# EAGLE design M115 (EAGLE 6.6.0)
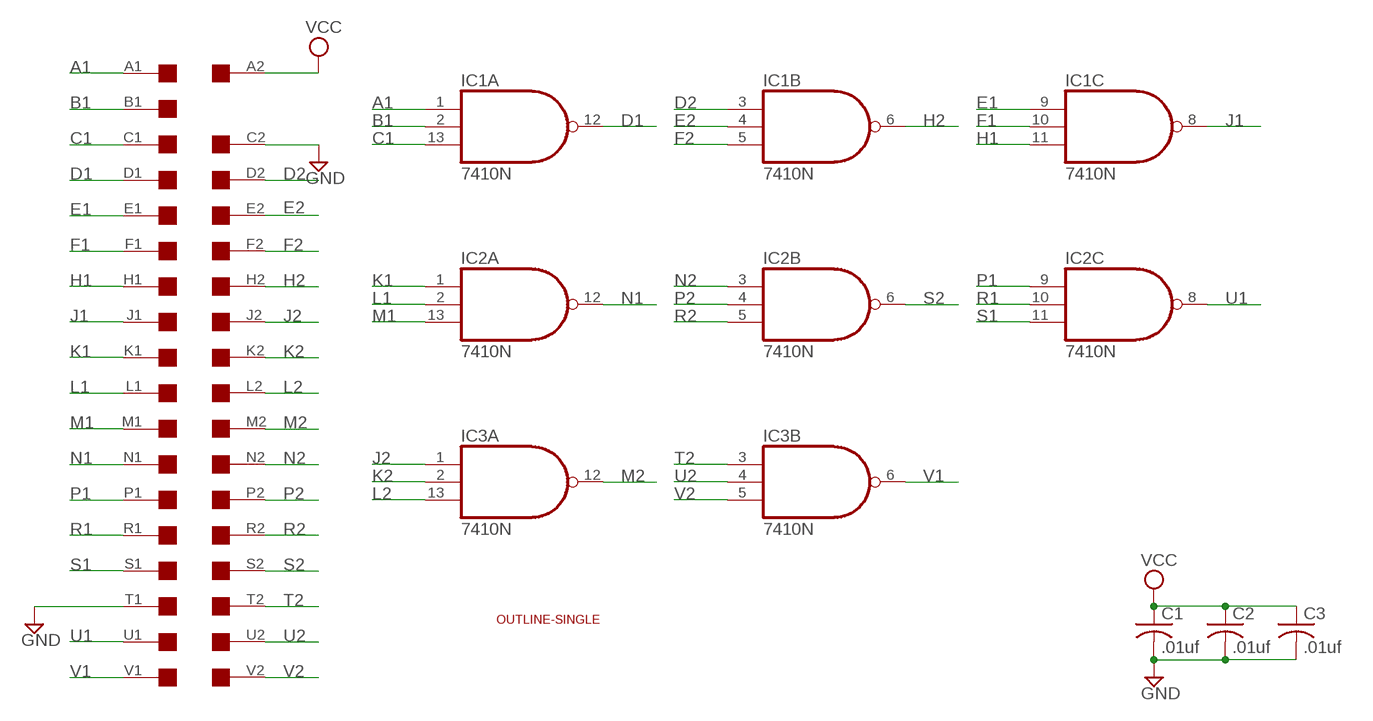
[diagram p0: schematic, sheet 1]

## Parts
C1  .01uf  C-US050-025X075  [C050-025X075]
C2  .01uf  C-US050-025X075  [C050-025X075]
C3  .01uf  C-US050-025X075  [C050-025X075]
IC1  7410N  [DIL14]
IC2  7410N  [DIL14]
IC3  7410N  [DIL14]
U$1  SINGLE  [EDGE-CON2]
U$4  OUTLINE-SINGLE  [SINGLE]

## Nets
A1: IC1.1(A:I0) U$1.A1
B1: IC1.2(A:I1) U$1.B1
C1: IC1.13(A:I2) U$1.C1
D1: IC1.12(A:O) U$1.D1
D2: IC1.3(B:I0) U$1.D2
E1: IC1.9(C:I0) U$1.E1
E2: IC1.4(B:I1) U$1.E2
F1: IC1.10(C:I1) U$1.F1
F2: IC1.5(B:I2) U$1.F2
GND: C1.2 C2.2 C3.2 U$1.C2 U$1.T1
H1: IC1.11(C:I2) U$1.H1
H2: IC1.6(B:O) U$1.H2
J1: IC1.8(C:O) U$1.J1
J2: IC3.1(A:I0) U$1.J2
K1: IC2.1(A:I0) U$1.K1
K2: IC3.2(A:I1) U$1.K2
L1: IC2.2(A:I1) U$1.L1
L2: IC3.13(A:I2) U$1.L2
M1: IC2.13(A:I2) U$1.M1
M2: IC3.12(A:O) U$1.M2
N1: IC2.12(A:O) U$1.N1
N2: IC2.3(B:I0) U$1.N2
P1: IC2.9(C:I0) U$1.P1
P2: IC2.4(B:I1) U$1.P2
R1: IC2.10(C:I1) U$1.R1
R2: IC2.5(B:I2) U$1.R2
S1: IC2.11(C:I2) U$1.S1
S2: IC2.6(B:O) U$1.S2
T2: IC3.3(B:I0) U$1.T2
U1: IC2.8(C:O) U$1.U1
U2: IC3.4(B:I1) U$1.U2
V1: IC3.6(B:O) U$1.V1
V2: IC3.5(B:I2) U$1.V2
VCC: C1.1 C2.1 C3.1 U$1.A2
Unconnected: IC3.8(C:O) IC3.9(C:I0) IC3.10(C:I1) IC3.11(C:I2) U$1.B2

## Power pins joined to a net without a drawn wire
GND: IC1.7(P:GND) IC2.7(P:GND) IC3.7(P:GND)
VCC: IC1.14(P:VCC) IC2.14(P:VCC) IC3.14(P:VCC)

## Library data of the parts
C1-C3 = rcl:C-US: CAPACITOR, American symbol
IC1-IC3 = 74xx-us:74*10: Triple 3-input NAND gate
U$1 = dec-con:SINGLE: Single-Height DEC board
U$4 = dec-con:OUTLINE-*: Board outlines for DEC boards.

## Board
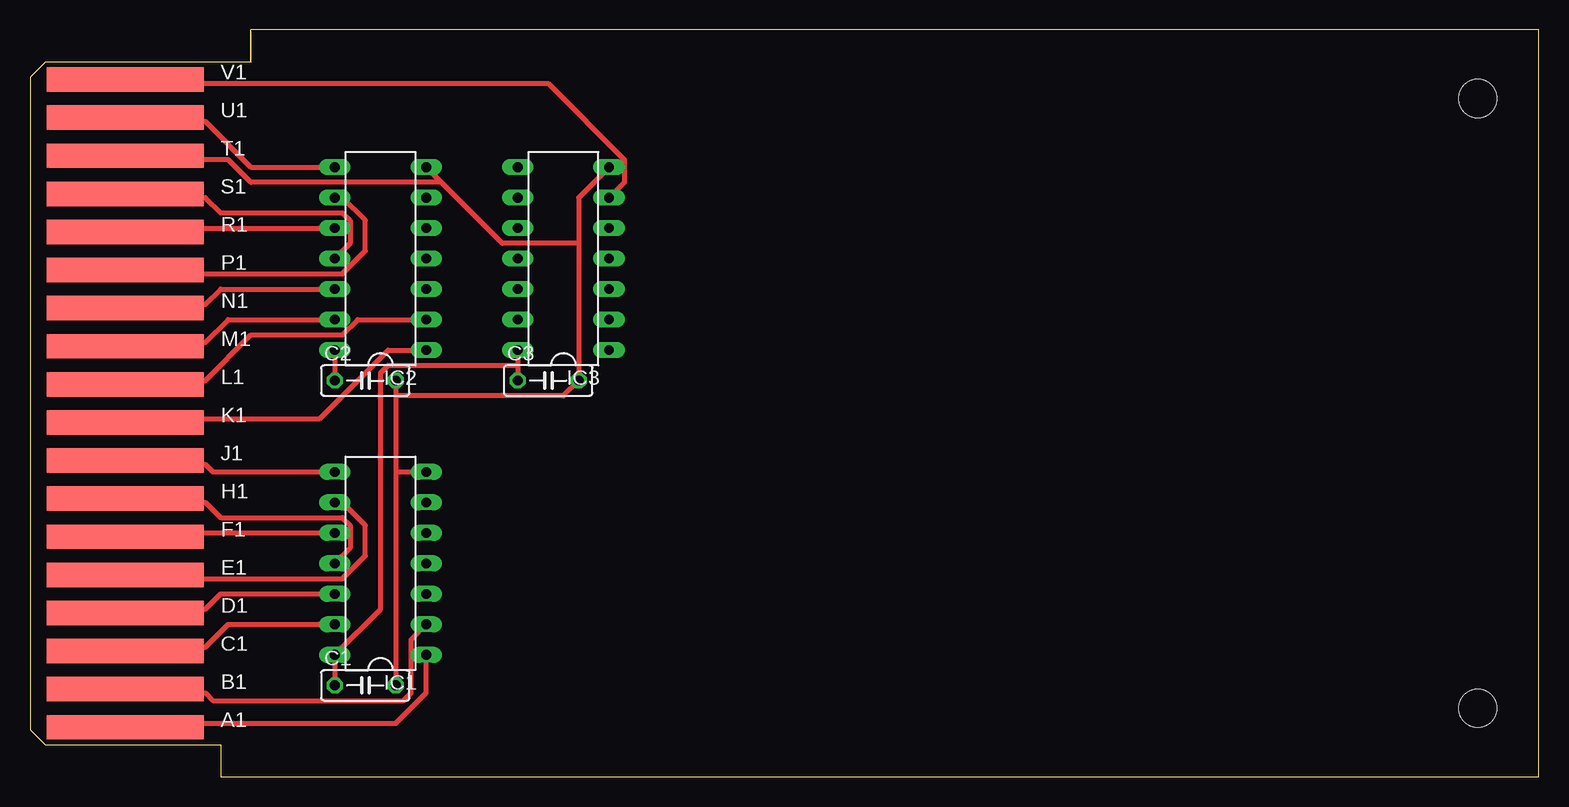
[diagram p1: board, top side]
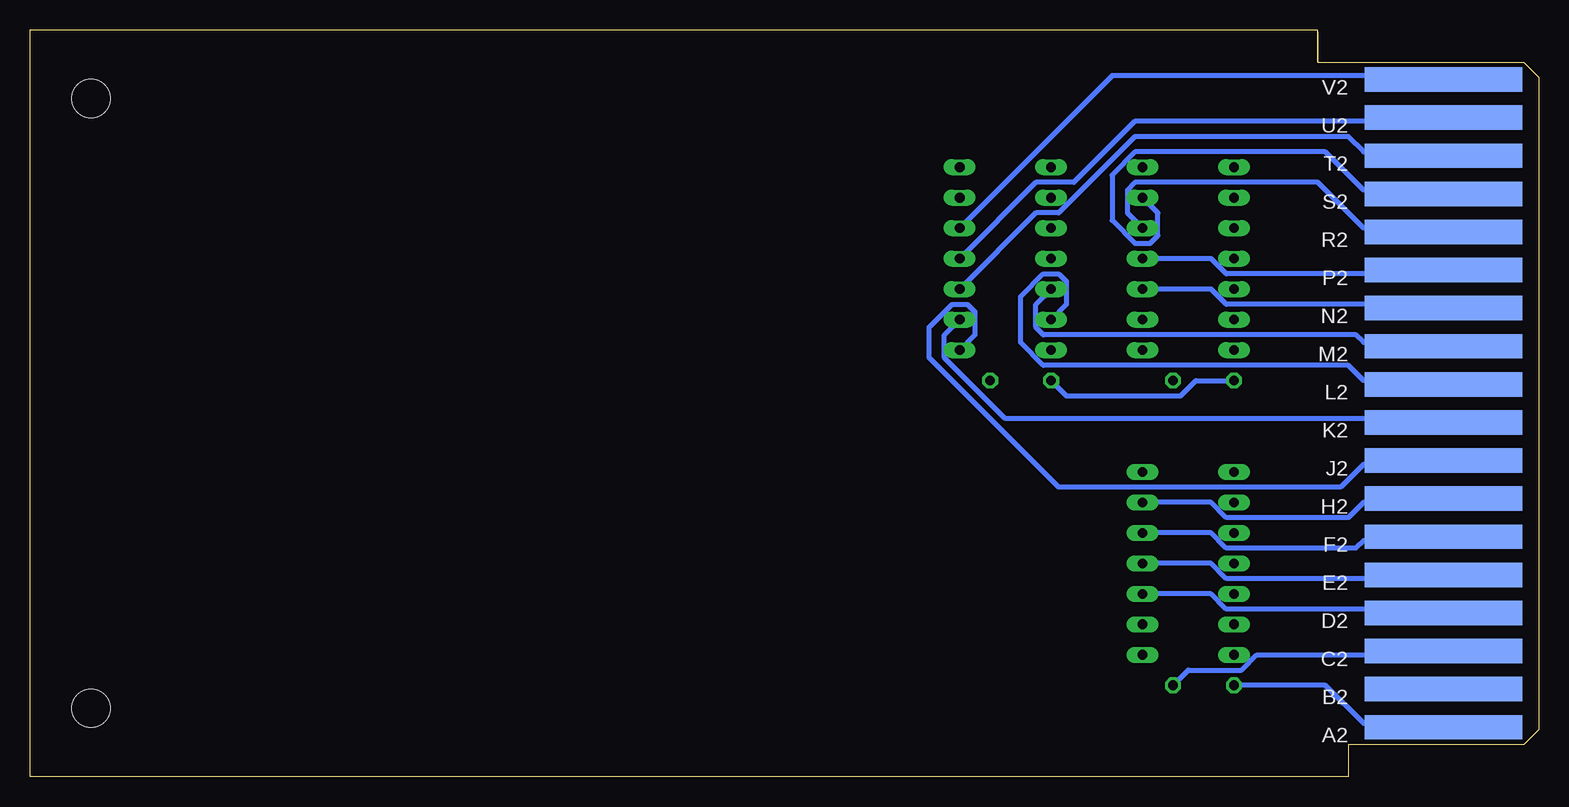
[diagram p2: board, bottom side, seen from below]

Size 125.73 x 62.23 mm. Coordinates in mm from the lower left corner, seen from the top.
Copper layers (1+16): Top 0.035mm / dielectric 1.5mm / Bottom 0.035mm
Design rules "16mils": minimum track width 16mil, minimum drill 32mil, track to track 15mil, track to pad 10mil, pad to pad 10mil, via to via 10mil, smd to smd 10mil, copper to edge 13mil, drill to drill 10mil, minimum pad ring 10mil, minimum via ring 8mil, stop-mask expansion 0mil, vias tented up to drill 0mil, thermal gap 10mil

### Footprints (pad centres in the part's own frame; a part is rotated, then mirrored left to right if it is on the bottom)
C050-025X075 = drill 0.813 octagon: 1 -2.54,0; 2 2.54,0
DIL14 = drill 0.813 long: 1 -7.62,-3.81; 2 -5.08,-3.81; 3 -2.54,-3.81; 4 0,-3.81; 5 2.54,-3.81; 6 5.08,-3.81; 7 7.62,-3.81; 8 7.62,3.81; 9 5.08,3.81; 10 2.54,3.81; 11 0,3.81; 12 -2.54,3.81; 13 -5.08,3.81; 14 -7.62,3.81
EDGE-CON2 = smd 13.106 x 2.032: A1 7.938,4.128; B1 7.938,7.303; C1 7.938,10.477; D1 7.938,13.652; E1 7.938,16.828; F1 7.938,20.003; H1 7.938,23.177; J1 7.938,26.352; K1 7.938,29.527; L1 7.938,32.703; M1 7.938,35.877; N1 7.938,39.053; P1 7.938,42.227; R1 7.938,45.403; S1 7.938,48.578; T1 7.938,51.752; U1 7.938,54.928; V1 7.938,58.102 | smd 13.106 x 2.032 bottom: A2 7.938,4.128; B2 7.938,7.303; C2 7.938,10.477; D2 7.938,13.652; E2 7.938,16.828; F2 7.938,20.003; H2 7.938,23.177; J2 7.938,26.352; K2 7.938,29.527; L2 7.938,32.703; M2 7.938,35.877; N2 7.938,39.053; P2 7.938,42.227; R2 7.938,45.403; S2 7.938,48.578; T2 7.938,51.752; U2 7.938,54.928; V2 7.938,58.102
SINGLE = hole 3.175: 120.65,56.515; 120.65,5.715

### Placement (x,y rotation side)
C1  27.94,7.62 0 top
C2  27.94,33.02 0 top
C3  43.18,33.02 0 top
IC1  29.21,17.78 90 top
IC2  29.21,43.18 90 top
IC3  44.45,43.18 90 top
U$1  0,0 0 top
U$4  0,0 0 top

### Tracks (layer width: path | path; a pad name or v marks a point on that pad's centre or on a via)
A1
  Top 0.406: IC1.1 33.02,6.99 30.48,4.45 8.26,4.45 U$1.A1
B1
  Top 0.406: IC1.2 31.75,11.43 31.75,6.99 31.12,6.35 15.24,6.35 14.61,6.99 8.26,6.99 U$1.B1
C1
  Top 0.406: IC1.13 16.51,12.7 14.61,10.79 8.26,10.79 U$1.C1
D1
  Top 0.406: IC1.12 15.88,15.24 14.61,13.97 8.26,13.97 U$1.D1
D2
  Bottom 0.406: IC1.3 27.31,15.24 26.04,13.97 8.26,13.97 U$1.D2
E1
  Top 0.406: IC1.9 26.04,22.86 27.94,20.95 27.94,18.41 26.04,16.51 8.26,16.51 U$1.E1
E2
  Bottom 0.406: IC1.4 27.31,17.78 26.04,16.51 8.26,16.51 U$1.E2
F1
  Top 0.406: IC1.10 8.26,20.32 U$1.F1
F2
  Bottom 0.406: IC1.5 27.31,20.32 26.04,19.05 15.24,19.05 14.61,19.68 8.26,19.68 U$1.F2
GND
  Top 0.406: C2.2 30.48,31.75 | 30.48,31.75 30.48,25.4 | 30.48,25.4 C1.2 | 30.48,25.4 IC1.7 | 45.72,44.45 45.72,48.26 IC3.7 | 45.72,44.45 C3.2 44.45,31.75 30.48,31.75 | 34.29,49.53 39.37,44.45 45.72,44.45 | 34.29,49.53 IC2.7 | 34.29,49.53 18.42,49.53 16.51,51.44 8.26,51.44 U$1.T1
  Bottom 0.406: C1.2 29.21,8.89 24.77,8.89 23.5,10.16 8.26,10.16 U$1.C2
H1
  Top 0.406: IC1.11 26.67,19.05 26.67,20.95 26.04,21.59 15.88,21.59 14.61,22.86 8.26,22.86 U$1.H1
H2
  Bottom 0.406: IC1.6 27.31,22.86 26.04,21.59 15.88,21.59 14.61,22.86 8.26,22.86 U$1.H2
J1
  Top 0.406: IC1.8 15.24,25.4 14.61,26.04 8.26,26.04 U$1.J1
J2
  Bottom 0.406: IC3.1 46.99,36.83 46.99,38.73 47.63,39.37 48.9,39.37 50.8,37.47 50.8,34.92 40.01,24.13 16.51,24.13 14.61,26.04 8.26,26.04 U$1.J2
K1
  Top 0.406: IC2.1 29.85,35.56 24.13,29.84 8.26,29.84 U$1.K1
K2
  Bottom 0.406: IC3.2 49.53,36.83 49.53,34.92 44.45,29.84 8.26,29.84 U$1.K2
L1
  Top 0.406: IC2.2 27.31,38.1 26.04,36.83 18.42,36.83 14.61,33.02 8.26,33.02 U$1.L1
L2
  Bottom 0.406: IC3.13 39.37,39.37 39.37,41.27 40.01,41.91 41.28,41.91 43.18,40.01 43.18,36.2 41.28,34.29 15.88,34.29 14.61,33.02 8.26,33.02 U$1.L2
M1
  Top 0.406: IC2.13 16.51,38.1 14.61,36.2 8.26,36.2 U$1.M1
M2
  Bottom 0.406: IC3.12 41.91,39.37 41.91,37.47 41.28,36.83 15.24,36.83 14.61,36.2 8.26,36.2 U$1.M2
N1
  Top 0.406: IC2.12 15.88,40.64 14.61,39.37 8.26,39.37 U$1.N1
N2
  Bottom 0.406: IC2.3 27.31,40.64 26.04,39.37 8.26,39.37 U$1.N2
P1
  Top 0.406: IC2.9 26.04,48.26 27.94,46.35 27.94,43.81 26.04,41.91 8.26,41.91 U$1.P1
P2
  Bottom 0.406: IC2.4 27.31,43.18 26.04,41.91 8.26,41.91 U$1.P2
R1
  Top 0.406: IC2.10 8.26,45.72 U$1.R1
R2
  Bottom 0.406: IC2.5 34.29,46.99 34.29,48.9 33.66,49.53 18.42,49.53 14.61,45.72 8.26,45.72 U$1.R2
S1
  Top 0.406: IC2.11 26.67,44.45 26.67,46.35 26.04,46.99 15.88,46.99 14.61,48.26 8.26,48.26 U$1.S1
S2
  Bottom 0.406: IC2.6 31.75,46.99 31.75,45.09 32.39,44.45 33.66,44.45 35.56,46.35 35.56,50.16 33.66,52.07 17.78,52.07 14.61,48.9 8.26,48.9 U$1.S2
T2
  Bottom 0.406: IC3.3 41.91,46.99 40.01,46.99 33.66,53.34 15.88,53.34 14.61,52.07 8.26,52.07 U$1.T2
U1
  Top 0.406: IC2.8 18.42,50.8 14.61,54.61 8.26,54.61 U$1.U1
U2
  Bottom 0.406: IC3.4 41.91,49.53 38.74,49.53 33.66,54.61 8.26,54.61 U$1.U2
V1
  Top 0.406: IC3.6 49.53,49.53 49.53,51.44 43.18,57.78 8.26,57.78 U$1.V1
V2
  Bottom 0.406: IC3.5 35.56,58.42 8.26,58.42 U$1.V2
VCC
  Top 0.406: IC2.14 C2.1 | IC3.14 40.64,34.29 | 40.64,34.29 C3.1 | C1.1 IC1.14 29.21,13.97 29.21,33.66 29.85,34.29 40.64,34.29
  Bottom 0.406: C2.1 28.58,33.02 29.85,31.75 39.37,31.75 C3.1 | C1.1 17.78,7.62 14.61,4.45 8.26,4.45 U$1.A2